# EAGLE design URC-PASSTHROUGH-USB2 (EAGLE 9.6.2)
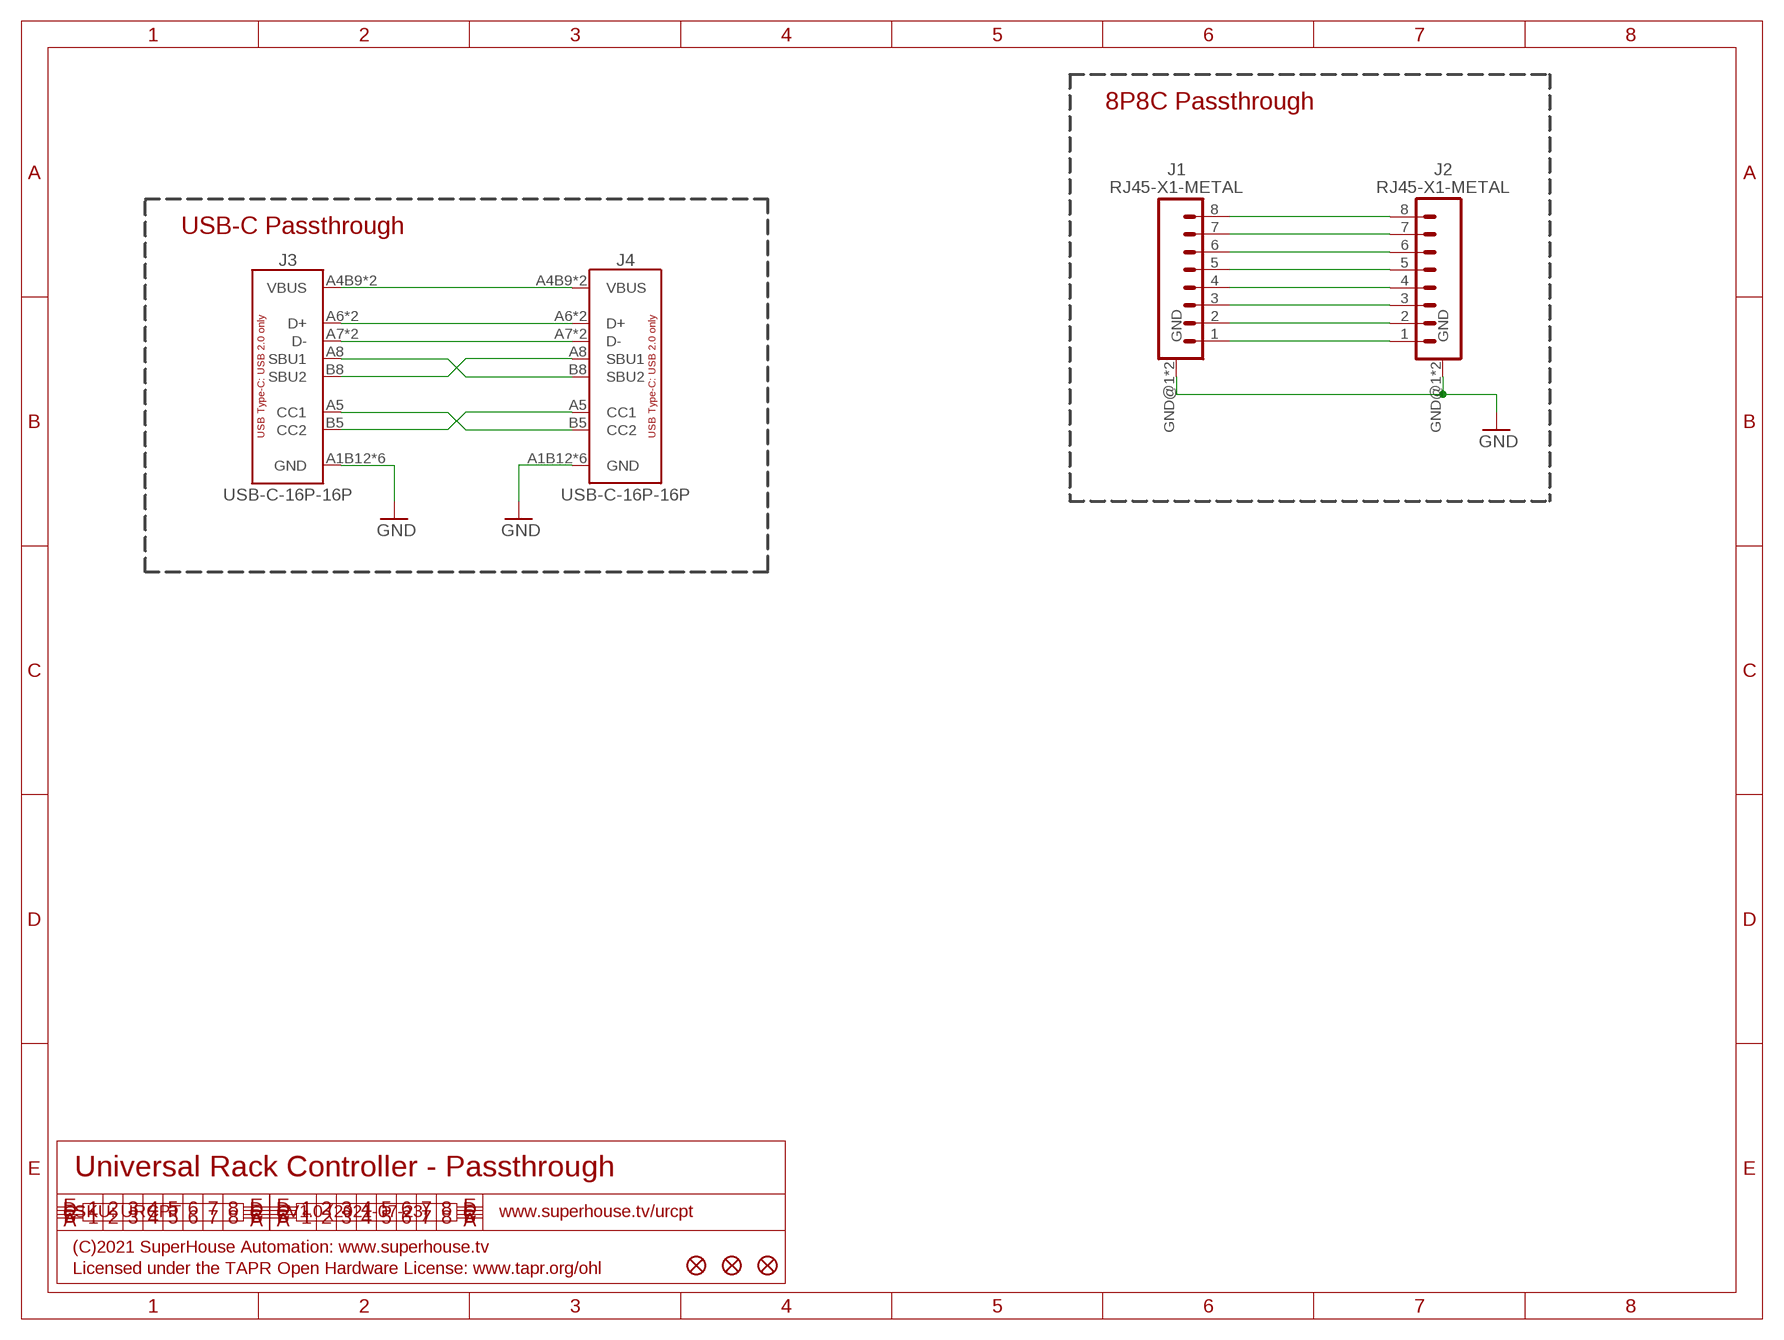
[diagram p0: schematic, sheet 1]

## Parts
FID1  FIDUCIAL1X2.5  [FIDUCIAL-1X2.5]
FID2  FIDUCIAL1X2.5  [FIDUCIAL-1X2.5]
FID3  FIDUCIAL1X2.5  [FIDUCIAL-1X2.5]
J1  RJ45-X1-METAL  [RJ45-1X1]
J2  RJ45-X1-METAL  [RJ45-1X1]
J3  USB-C-16P-16P  [USB-C-16P]
J4  USB-C-16P-16P  [USB-C-16P]

## Nets
GND: J1.GND@1(GND) J1.GND@2(GND) J2.GND@1(GND) J2.GND@2(GND) J3.A1B12(GND) J3.A12B1(GND) J3.FIX1(GND) J3.FIX2(GND) J3.FIX3(GND) J3.FIX4(GND) J4.A1B12(GND) J4.A12B1(GND) J4.FIX1(GND) J4.FIX2(GND) J4.FIX3(GND) J4.FIX4(GND)
N$1: J1.1 J2.1
N$2: J1.2 J2.2
N$3: J1.3 J2.3
N$4: J1.4 J2.4
N$5: J1.5 J2.5
N$6: J1.6 J2.6
N$7: J1.7 J2.7
N$8: J1.8 J2.8
N$9: J3.A8(SBU1) J4.B8(SBU2)
N$10: J3.B8(SBU2) J4.A8(SBU1)
N$11: J3.A5(CC1) J4.B5(CC2)
N$12: J3.B5(CC2) J4.A5(CC1)
N$17: J3.A6(D+) J3.B6(D+) J4.A6(D+) J4.B6(D+)
N$20: J3.A4B9(VBUS) J3.A9B4(VBUS) J4.A4B9(VBUS) J4.A9B4(VBUS)
N$21: J3.A7(D-) J3.B7(D-) J4.A7(D-) J4.B7(D-)

## Notes on the sheet
- 8P8C Passthrough
- USB-C Passthrough
- Universal Rack Controller - Passthrough
- SKU: URCPT | V1.0 (2021-07-23) | www.superhouse.tv/urcpt
- (C)2021 SuperHouse Automation: www.superhouse.tv
- Licensed under the TAPR Open Hardware License: www.tapr.org/ohl

## Library data of the parts
FID1-FID3 = SuperHouse-Symbols:FIDUCIAL: Fiducial Alignment Points Various fiducial points for machine vision alignment.
J1 J2 = SuperHouse-Connectors:RJ45-X1: RJ45 socket with GND connection
J3 J4 = SuperHouse-Connectors:USB-C-16P: USB-C socket with 16 pins, suitable only for backward compatibility with USB 2

## Board
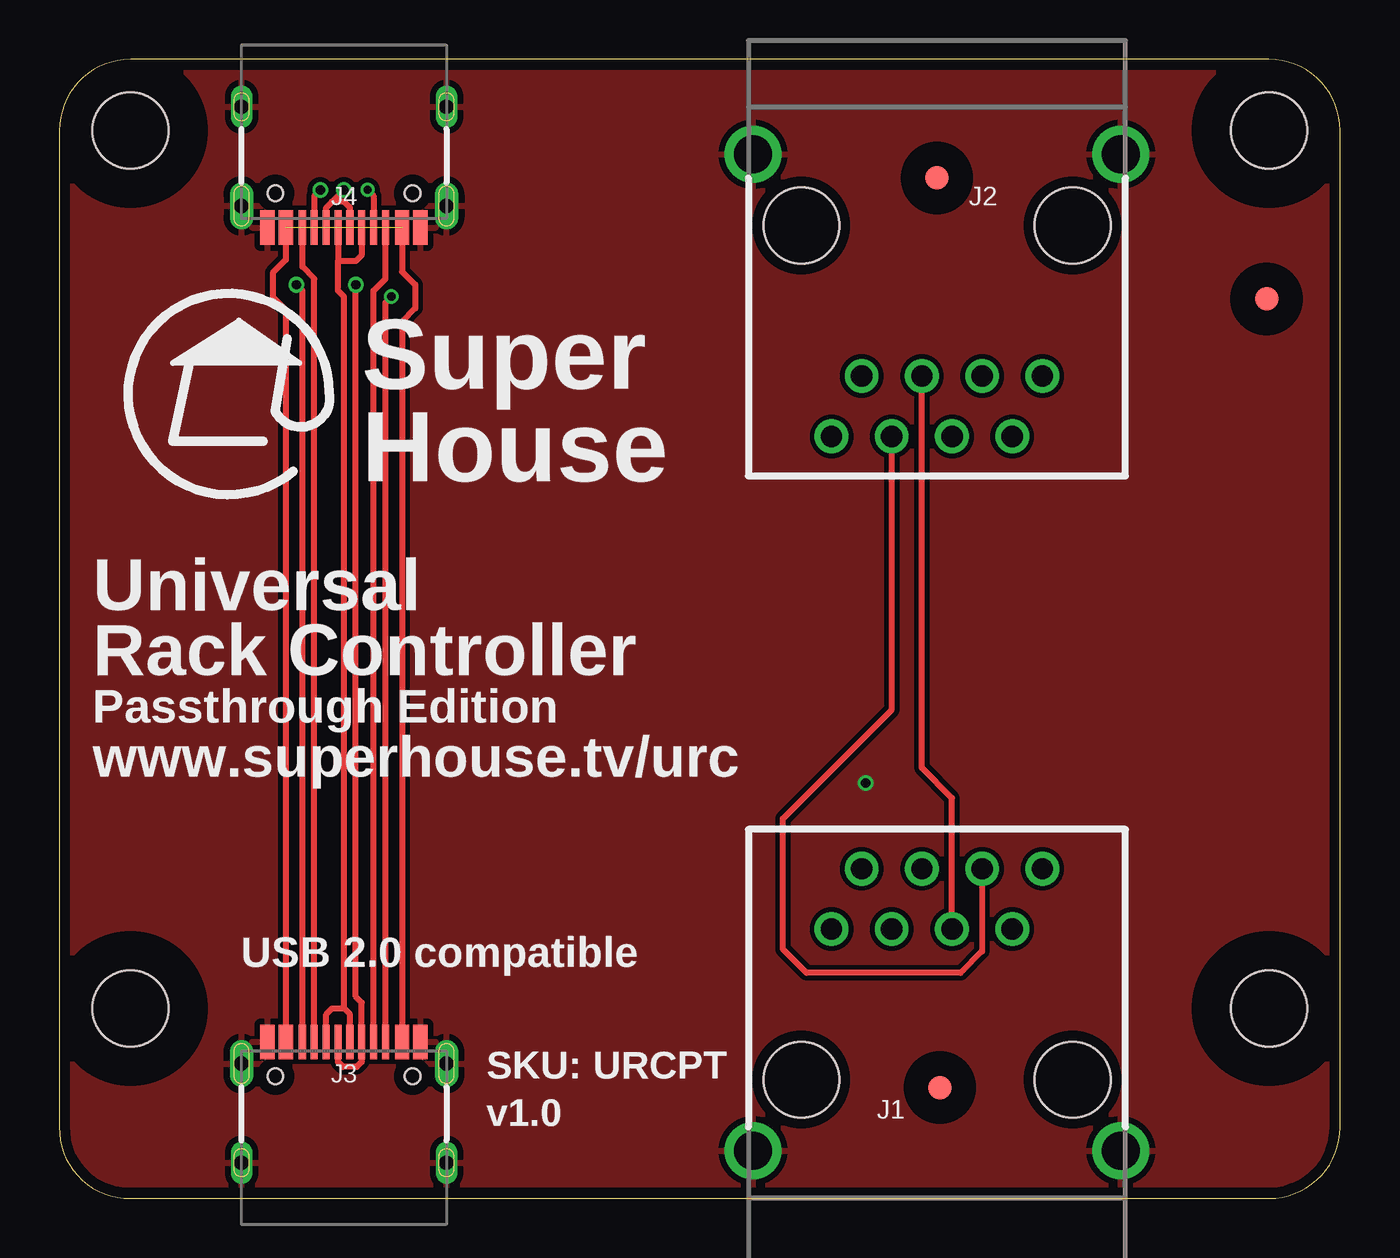
[diagram p1: board, top side]
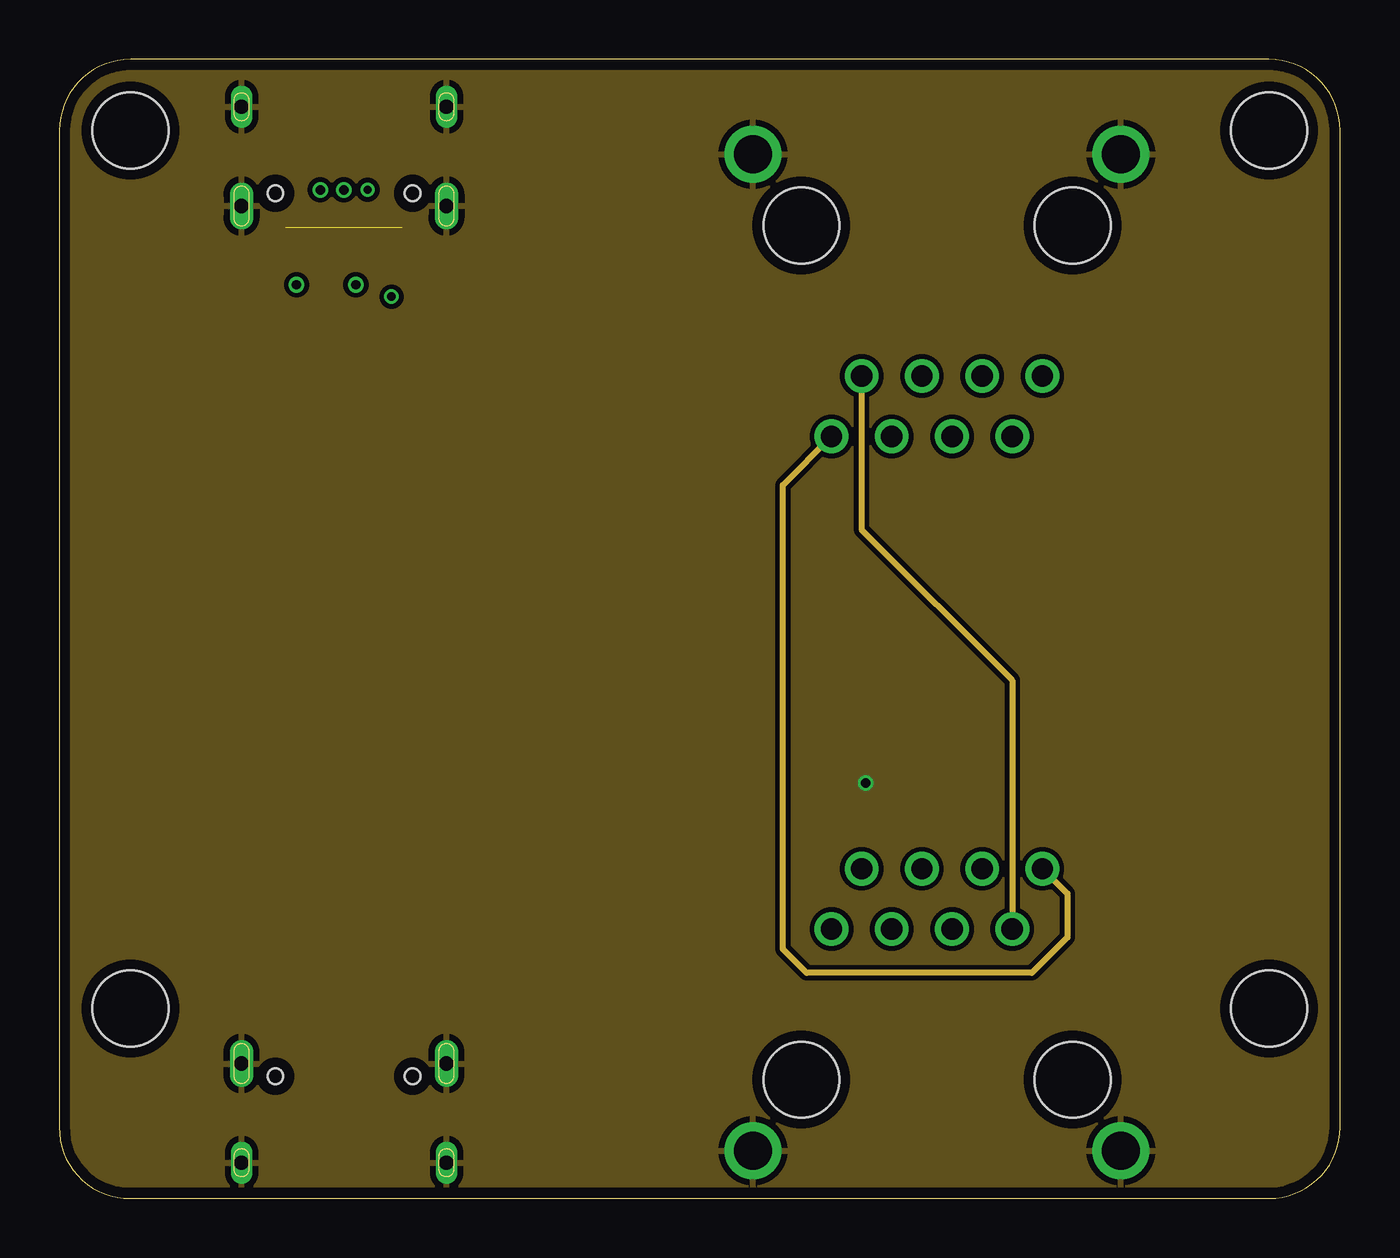
[diagram p2: board, inner layer Route2]
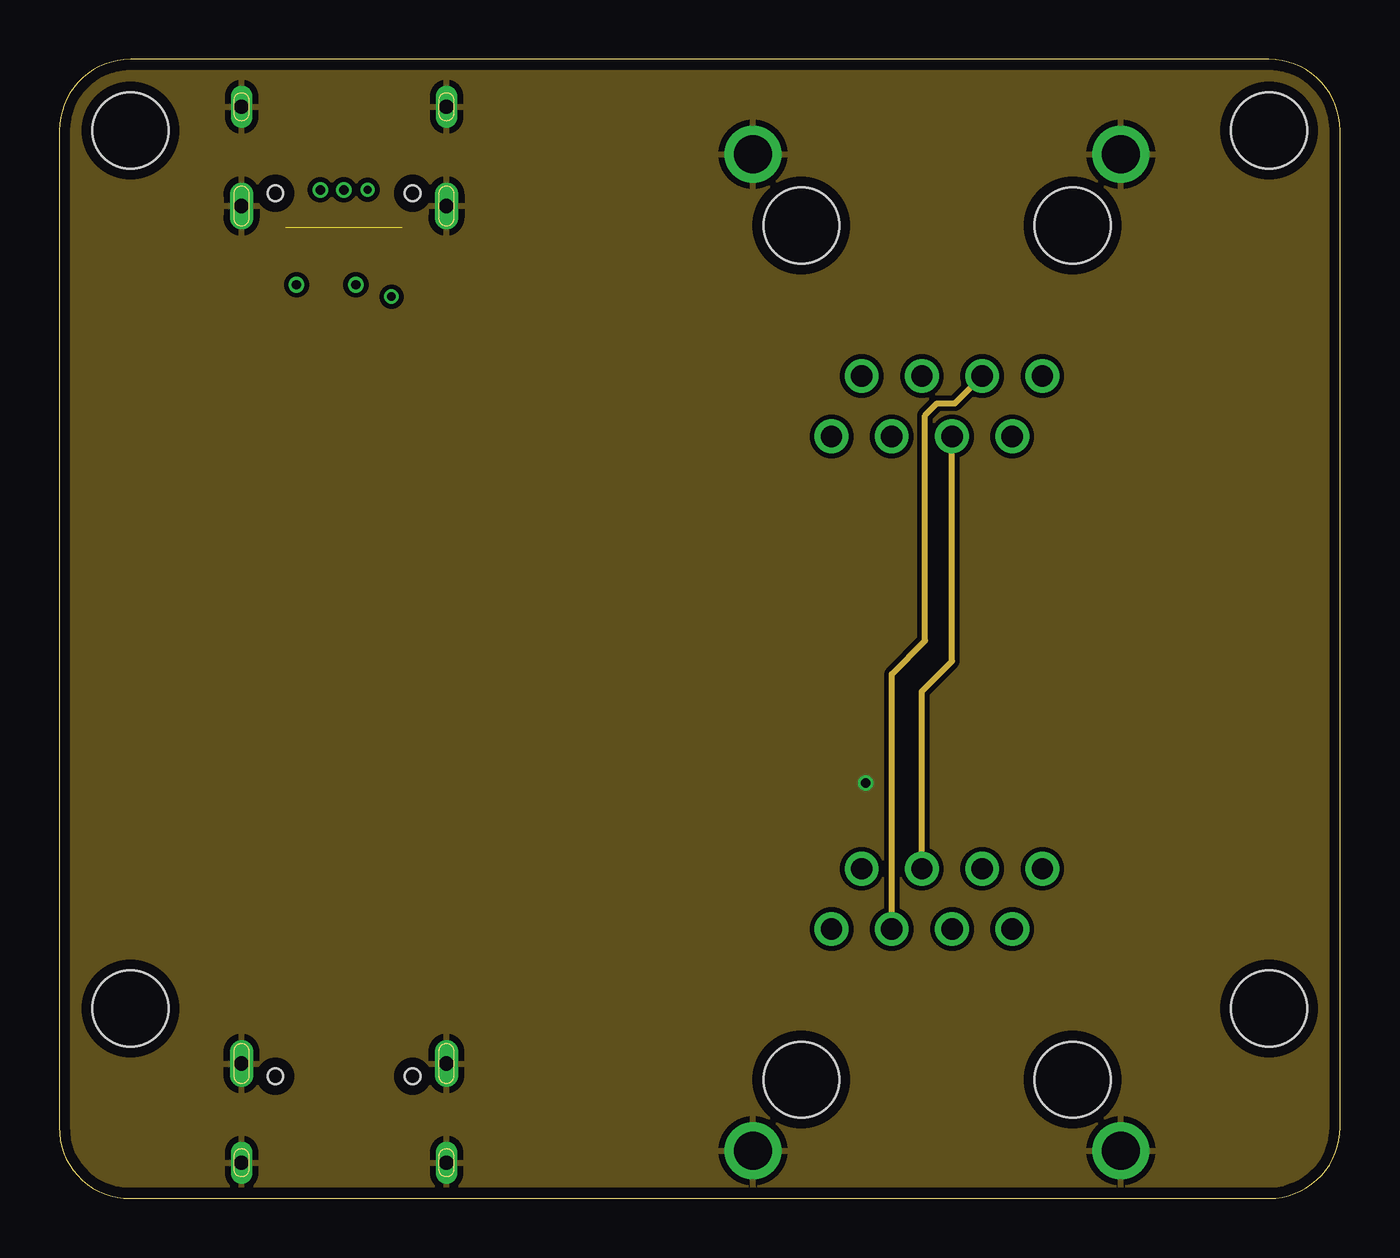
[diagram p3: board, inner layer Route15]
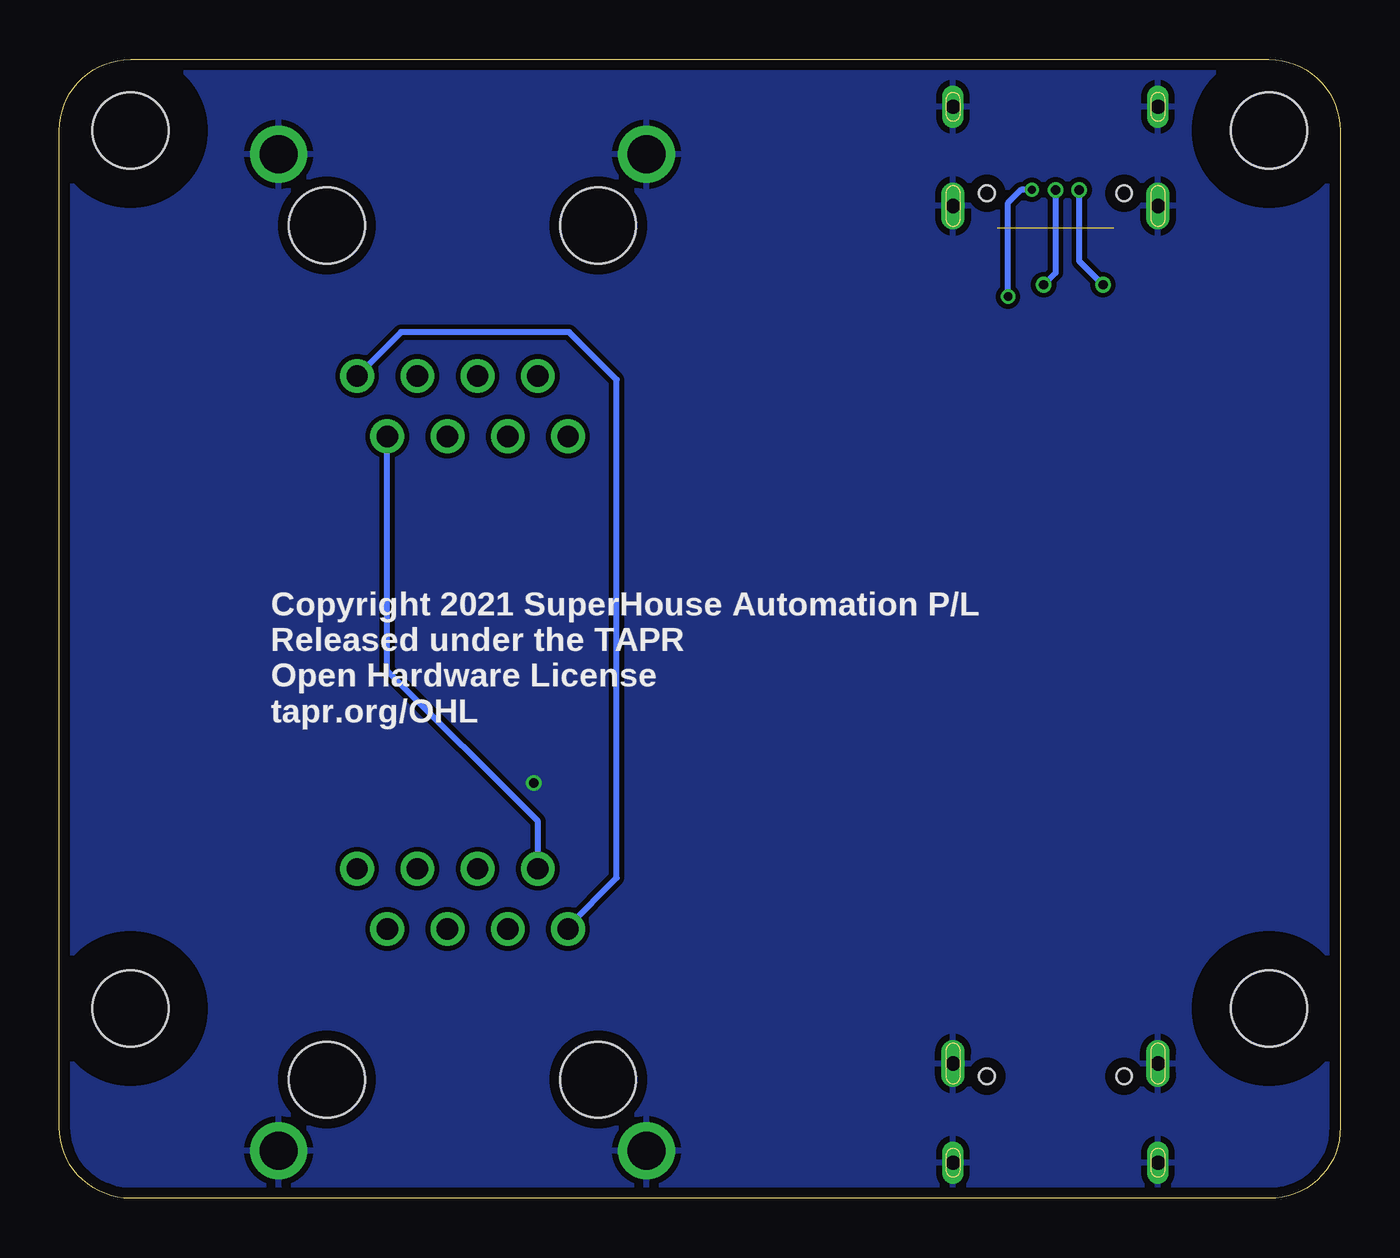
[diagram p4: board, bottom side, seen from below]

Size 54 x 48 mm. Coordinates in mm from the lower left corner, seen from the top.
Outline: 51,0 arc90 54,3 54,45 arc90 51,48 3,48 arc90 0,45 0,3 arc92 3,0 51,0
Copper layers (1+2*15+16): Top 0.035mm / dielectric 1.5mm / Route2 0.035mm / dielectric 0.15mm / Route15 0.035mm / dielectric 0.2mm / Bottom 0.035mm
Design rules "SuperHouse-Design-Rules *": minimum track width 5mil, minimum drill 0.35mm, track to track 8mil, track to pad 8mil, pad to pad 8mil, via to via 8mil, smd to smd 6mil, copper to edge 18mil, drill to drill 8mil, minimum pad ring 5mil, minimum via ring 5mil, stop-mask expansion 4mil, vias tented up to drill 0.5mm, thermal gap 10mil
Holes 3.2 mm at 51,8 3,8 3,45 51,45
tRestrict: area 49.9,36.9 to 51.9,38.9; area 36,42 to 38,44; area 36.1,3.7 to 38.1,5.7; area 47.8,41.8 to 54.2,48.2; area 47.8,4.8 to 54.2,11.2; area -0.2,4.8 to 6.2,11.2; area -0.2,41.8 to 6.2,48.2
bRestrict: area 47.8,41.8 to 54.2,48.2; area -0.2,41.8 to 6.2,48.2; area 47.8,4.8 to 54.2,11.2; area -0.2,4.8 to 6.2,11.2

### Footprints (pad centres in the part's own frame; a part is rotated, then mirrored left to right if it is on the bottom)
FIDUCIAL-1X2.5 = smd 1 x 1: 1 0,0
RJ45-1X1 = drill 0.9 pad 1.422: 1 -4.445,6.35; 2 -3.175,8.89; 3 -1.905,6.35; 4 -0.635,8.89; 5 0.635,6.35; 6 1.905,8.89; 7 3.175,6.35; 8 4.445,8.89 | drill 1.6: GND@1 -7.75,-3; GND@2 7.75,-3 | hole 3.2: -5.715,0; 5.715,0
USB-C-16P = smd 0.6 x 1.45: A1B12 -3.225,5.095; A4B9 -2.45,5.095; A9B4 2.45,5.095; A12B1 3.225,5.095 | smd 0.3 x 1.45: A5 -1.25,5.095; A6 -0.25,5.095; A7 0.25,5.095; A8 1.25,5.095; B5 1.75,5.095; B6 0.75,5.095; B7 -0.75,5.095; B8 -1.75,5.095 | drill 0.6 pad 0.8 long: FIX1 -4.32,0; FIX4 4.32,0 | drill 0.6 pad 1 long: FIX2 -4.32,4.18; FIX3 4.32,4.18 | hole 0.65: 2.89,3.65; -2.89,3.65

### Placement (x,y rotation side)
FID1  50.9,37.9 90 top
FID2  37,43 90 top
FID3  37.12,4.67 90 top
J1  37,5 0 top
J2  37,41 180 top
J3  12,1.5 0 top
J4  12,46 180 top

### Tracks (layer width: path | path; a pad name or v marks a point on that pad's centre or on a via)
GND  (via drill 0.4)
  other vias: 34,17.5
  pour Bottom: 3,0 arc-90 0,3 0,45 arc-90 3,48 51,48 arc-90 54,45 54,3 arc-90 51,0
  pour Route2: 0,3 arc90 3,0 51,0 arc90 54,3 54,45 arc90 51,48 3,48 arc90 0,45
  pour Top: 3,0 arc-90 0,3 0,45 arc-90 3,48 51,48 arc-90 54,45 54,3 arc-90 51,0
  pour Route15: 0,3 arc90 3,0 51,0 arc90 54,3 54,45 arc90 51,48 3,48 arc90 0,45
N$1
  Bottom 0.254: J1.1 32.55,11.45 30.5,13.5 30.5,34.5 32.5,36.5 39.59,36.5 J2.1
N$2
  Bottom 0.254: J1.2 33.83,15.89 40.17,22.24 J2.2
N$3
  Route15 0.254: J1.3 35.09,22.09 36.5,23.5 36.5,33 37,33.5 37.76,33.5 J2.3
N$4
  Route15 0.254: J1.4 36.37,21.36 37.63,22.64 J2.4
N$5
  Top 0.254: J1.5 37.63,16.86 36.37,18.14 J2.5
N$6
  Top 0.254: J1.6 38.91,10.4 38,9.5 31.5,9.5 30.5,10.5 30.5,16 35.09,20.59 J2.6
N$7
  Route2 0.254: J1.7 40.17,21.82 33.83,28.18 J2.7
N$8
  Route2 0.254: J2.8 30.5,30.05 30.5,10.5 31.5,9.5 41,9.5 42.5,11 42.5,12.84 J1.8
N$9
  Top 0.254: J3.A8 13.25,38.25 13.75,38.75 J4.B8
N$10  (via drill 0.4)
  Top 0.254: v10,38.5 10.25,38.25 J3.B8 | v11,42.5 10.75,42.25 J4.A8
  Bottom 0.254: v10,38.5 11,39.5 v11,42.5
N$11
  Top 0.254: J3.A5 10.75,38.75 10.25,39.25 J4.B5
N$12  (via drill 0.35)
  Top 0.254: J3.B5 13.75,37.75 v14,38 | v13,42.5 13.25,42.25 J4.A5
  Bottom 0.254: v14,38 14,41.95 13.45,42.5 v13,42.5
N$17  (via drill 0.4)
  Top 0.254: J3.A6 11.75,5.75 11.96,5.54 12.54,5.54 12.75,5.75 J3.B6 12.75,8.25 12.5,8.5 v12.5,38.5 | J4.B6 11.25,41.75 11.5,42 | J4.A6 12.25,41.75 12,42 11.5,42 | v12,42.5 11.5,42
  Bottom 0.254: v12,42.5 12,39 v12.5,38.5
N$20  (1 unrouted)
  Top 0.254: J4.A4B9 14.45,39.05 15,38.5 15,37.5 14.45,36.95 J3.A9B4 | J4.A9B4 9.55,39.55 9,39 9,38 9.55,37.45 J3.A4B9
N$21
  Top 0.254: J3.B7 11.25,7.75 11.5,8 12,8 | J3.A7 12.25,7.75 12,8 | 12,8 12,38 11.75,38.25 11.75,39.5 | J4.A7 11.75,39.5 | J4.B7 12.75,39.75 12.5,39.5 11.75,39.5

### Text on the board
tPlace: Super / House | Universal / Rack Controller | Passthrough Edition | www.superhouse.tv/urc | USB 2.0 compatible | SKU: URCPT | v1.0
bPlace: Copyright 2021 SuperHouse Automation P/L / Released under the TAPR / Open Hardware License / tapr.org/OHL